# Altium schematic sheet MotorInterface.SchDoc: Connection vers moteurs
size Letter; Organization: Robocup Ulaval; DocumentNumber: 8; Revision: 1.0; SheetNumber: 8; SheetTotal: 10; Version: Gamma 1.0; Conceptor: Philippe T. Simon B. Léonard G. Alexia B-L.
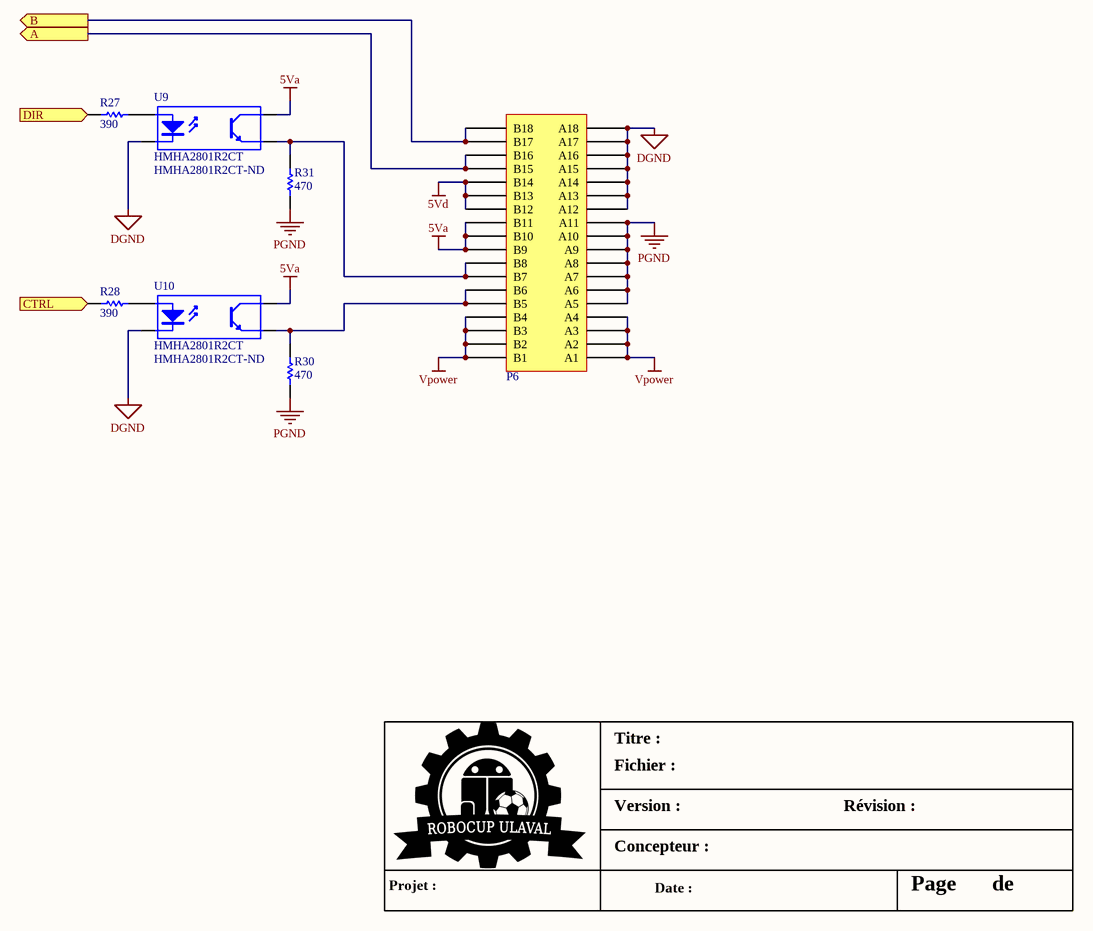
[diagram p0: MotorInterface.SchDoc]

## Parts
P6  0877159006  [0877159006]  (value not drawn)
R27  Resistance (Ohms): 390  [0603]  (hidden comment: RC0603JR-07390RL)
R28  Resistance (Ohms): 390  [0603]  (hidden comment: RC0603JR-07390RL)
R30  Resistance (Ohms): 470  [0603]  (hidden comment: RC0603JR-07470RL)
R31  Resistance (Ohms): 470  [0603]  (hidden comment: RC0603JR-07470RL)
U9  HMHA2801R2CT  Supplier Part Number 1: HMHA2801R2CT-ND  [SOIC127P700X220-4N]
U10  HMHA2801R2CT  Supplier Part Number 1: HMHA2801R2CT-ND  [SOIC127P700X220-4N]

## Ports
A (out), B (out), CTRL (in), DIR (in)

## Nets
5Va: P6.B9 P6.B10 P6.B11 U9.4(C) U10.4(C)
5Vd: P6.B12 P6.B13 P6.B14
DGND: P6.A12 P6.A13 P6.A14 P6.A15 P6.A16 P6.A17 P6.A18 U9.2(K) U10.2(K)
PGND: P6.A5 P6.A6 P6.A7 P6.A8 P6.A9 P6.A10 P6.A11 R30.1 R31.1
Vpower: P6.A1 P6.A2 P6.A3 P6.A4 P6.B1 P6.B2 P6.B3 P6.B4
A: P6.B15 P6.B16 ; port A
B: P6.B17 P6.B18 ; port B
CTRL: R28.1 ; port CTRL
DIR: R27.1 ; port DIR
NetP6_B5: P6.B5 P6.B6 R30.2 U10.3(E)
NetP6_B7: P6.B7 P6.B8 R31.2 U9.3(E)
NetR27_2: R27.2 U9.1(A)
NetR28_2: R28.2 U10.1(A)

## Notes on the sheet
- Titre :
- Version :
- Fichier :
- Révision :
- Projet :
- Concepteur :
- Date :
- Page
- de

## Library data of the parts
P6 = 0877159006: CONN PCI EXPRESS 36POS 1MM GOLD
R27 R28 = RC0603JR-07390RL: RES SMD 390 OHM 5% 1/10W 0603; Manufacturer: Yageo; Power (Watts): 0.1W, 1/10W; Temperature Coefficient: ±100ppm/°C; Supplier 1: Digi-Key; Manufacturer Part Number: RC0603JR-07390RL; RoHS: RoHS Compliant; Category: Resistors; Stock 1: 718727; Pricing 1: 1=0.15, 10=0.017, 25=0.012, 100=0.0067, 250=0.00508, 500=0.00408, 1000=0.003, 2500=0.0026 (CAD); Packaging: Cut Tape (CT); Tolerance: ±5%; Composition: Thick Film; Features: Moisture Resistant; Operating Temperature: -55°C ~ 155°C; Package / Case: 0603 (1608 Metric); Supplier Device Package: 0603; Size / Dimension: 0.063" L x 0.031" W (1.60mm x 0.80mm); Height: 0.022" (0.55mm); Number of Terminations: 2; ComponentLink1URL: http://www.yageo.com/documents/recent/PYu-RC_Group_51_RoHS_L_04.pdf; ComponentLink1Description: http://www.yageo.com/documents/recent/PYu-RC_Group_51_RoHS_L_04.pdf; Supplier Part Number 1: 311-390GRCT-ND
R30 R31 = RC0603JR-07470RL: RES SMD 470 OHM 5% 1/10W 0603; Manufacturer: Yageo; Power (Watts): 0.1W, 1/10W; Temperature Coefficient: ±100ppm/°C; Supplier 1: Digi-Key; Manufacturer Part Number: RC0603JR-07470RL; RoHS: RoHS Compliant; Category: Resistors; Stock 1: 968246; Pricing 1: 1=0.15, 10=0.017, 25=0.012, 100=0.0067, 250=0.00508, 500=0.00408, 1000=0.003, 2500=0.0026 (CAD); Packaging: Cut Tape (CT); Tolerance: ±5%; Composition: Thick Film; Features: Moisture Resistant; Operating Temperature: -55°C ~ 155°C; Package / Case: 0603 (1608 Metric); Supplier Device Package: 0603; Size / Dimension: 0.063" L x 0.031" W (1.60mm x 0.80mm); Height: 0.022" (0.55mm); Number of Terminations: 2; ComponentLink1URL: http://www.yageo.com/documents/recent/PYu-RC_Group_51_RoHS_L_04.pdf; ComponentLink1Description: http://www.yageo.com/documents/recent/PYu-RC_Group_51_RoHS_L_04.pdf; Supplier Part Number 1: 311-470GRCT-ND
U9 U10 = HMHA2801R2CT: OPTOISOLATOR 3.75KV TRANS 4-SO; Supplier 1: Digi-Key